# EAGLE design LEDARRAY (EAGLE 8.6.0)
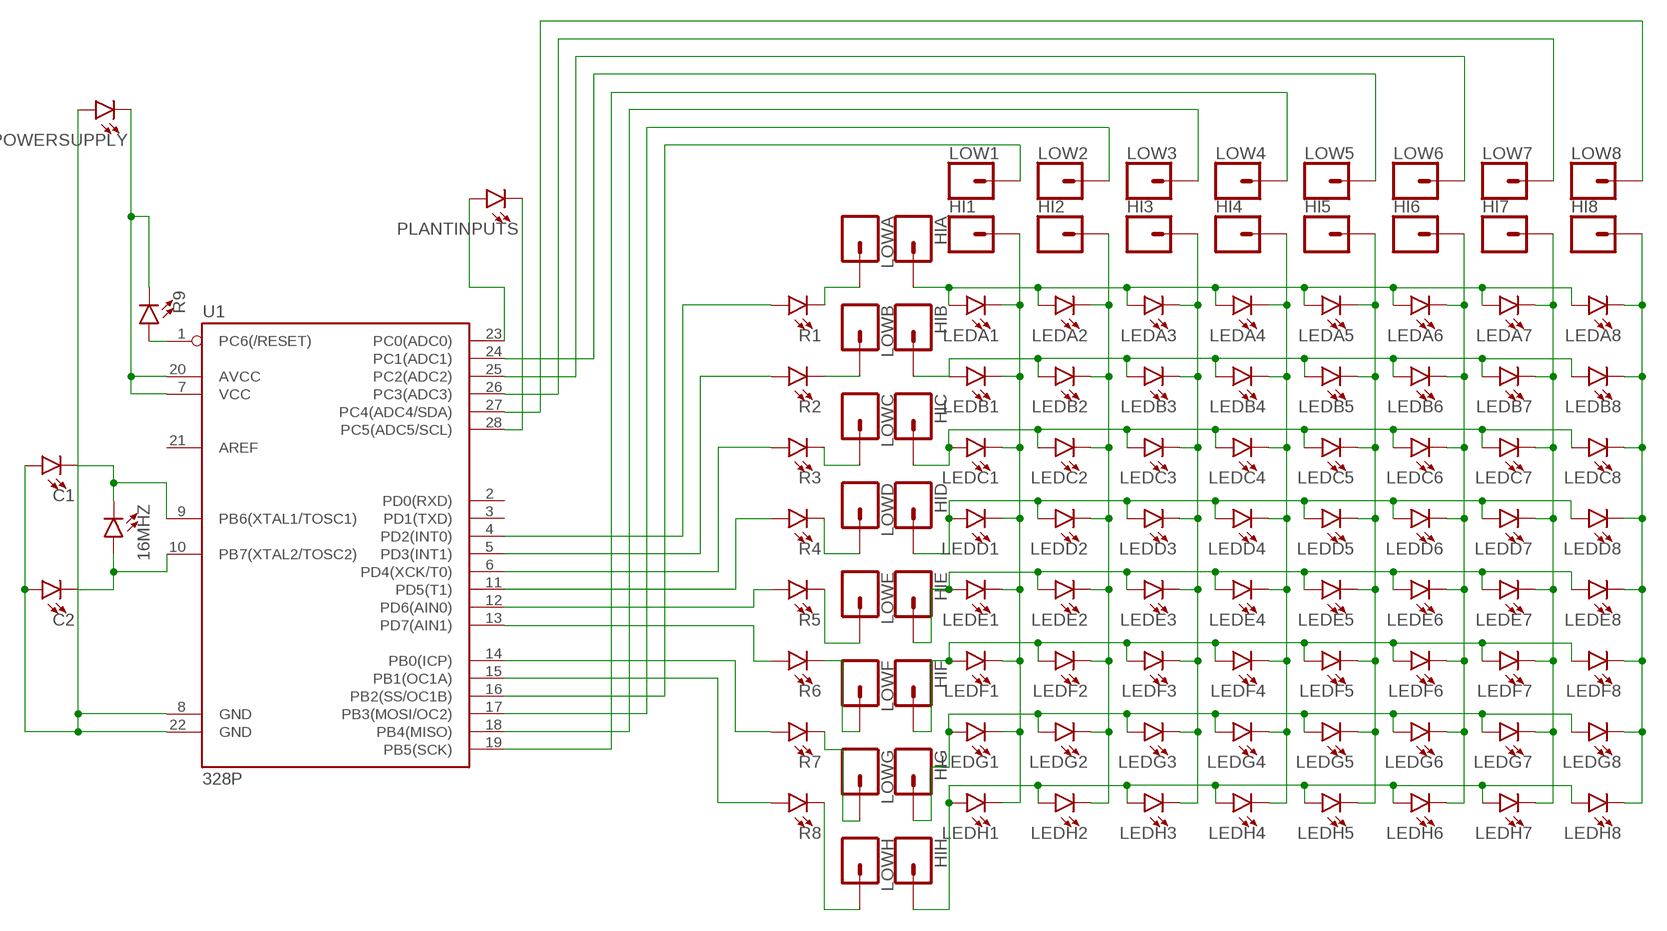
[diagram p0: schematic, sheet 1]

## Parts
16MHZ  LED3MM  [LED_3MM]
C1  LED3MM  [LED_3MM]
C2  LED3MM  [LED_3MM]
HI1  CONN_01PTH_NO_SILK_KIT  [1X01NS_KIT]
HI2  CONN_01PTH_NO_SILK_KIT  [1X01NS_KIT]
HI3  CONN_01PTH_NO_SILK_KIT  [1X01NS_KIT]
HI4  CONN_01PTH_NO_SILK_KIT  [1X01NS_KIT]
HI5  CONN_01PTH_NO_SILK_KIT  [1X01NS_KIT]
HI6  CONN_01PTH_NO_SILK_KIT  [1X01NS_KIT]
HI7  CONN_01PTH_NO_SILK_KIT  [1X01NS_KIT]
HI8  CONN_01PTH_NO_SILK_KIT  [1X01NS_KIT]
HIA  CONN_01PTH_NO_SILK_KIT  [1X01NS_KIT]
HIB  CONN_01PTH_NO_SILK_KIT  [1X01NS_KIT]
HIC  CONN_01PTH_NO_SILK_KIT  [1X01NS_KIT]
HID  CONN_01PTH_NO_SILK_KIT  [1X01NS_KIT]
HIE  CONN_01PTH_NO_SILK_KIT  [1X01NS_KIT]
HIF  CONN_01PTH_NO_SILK_KIT  [1X01NS_KIT]
HIG  CONN_01PTH_NO_SILK_KIT  [1X01NS_KIT]
HIH  CONN_01PTH_NO_SILK_KIT  [1X01NS_KIT]
LEDA1  LED3MM  [LED_3MM]
LEDA2  LED3MM  [LED_3MM]
LEDA3  LED3MM  [LED_3MM]
LEDA4  LED3MM  [LED_3MM]
LEDA5  LED3MM  [LED_3MM]
LEDA6  LED3MM  [LED_3MM]
LEDA7  LED3MM  [LED_3MM]
LEDA8  LED3MM  [LED_3MM]
LEDB1  LED3MM  [LED_3MM]
LEDB2  LED3MM  [LED_3MM]
LEDB3  LED3MM  [LED_3MM]
LEDB4  LED3MM  [LED_3MM]
LEDB5  LED3MM  [LED_3MM]
LEDB6  LED3MM  [LED_3MM]
LEDB7  LED3MM  [LED_3MM]
LEDB8  LED3MM  [LED_3MM]
LEDC1  LED3MM  [LED_3MM]
LEDC2  LED3MM  [LED_3MM]
LEDC3  LED3MM  [LED_3MM]
LEDC4  LED3MM  [LED_3MM]
LEDC5  LED3MM  [LED_3MM]
LEDC6  LED3MM  [LED_3MM]
LEDC7  LED3MM  [LED_3MM]
LEDC8  LED3MM  [LED_3MM]
LEDD1  LED3MM  [LED_3MM]
LEDD2  LED3MM  [LED_3MM]
LEDD3  LED3MM  [LED_3MM]
LEDD4  LED3MM  [LED_3MM]
LEDD5  LED3MM  [LED_3MM]
LEDD6  LED3MM  [LED_3MM]
LEDD7  LED3MM  [LED_3MM]
LEDD8  LED3MM  [LED_3MM]
LEDE1  LED3MM  [LED_3MM]
LEDE2  LED3MM  [LED_3MM]
LEDE3  LED3MM  [LED_3MM]
LEDE4  LED3MM  [LED_3MM]
LEDE5  LED3MM  [LED_3MM]
LEDE6  LED3MM  [LED_3MM]
LEDE7  LED3MM  [LED_3MM]
LEDE8  LED3MM  [LED_3MM]
LEDF1  LED3MM  [LED_3MM]
LEDF2  LED3MM  [LED_3MM]
LEDF3  LED3MM  [LED_3MM]
LEDF4  LED3MM  [LED_3MM]
LEDF5  LED3MM  [LED_3MM]
LEDF6  LED3MM  [LED_3MM]
LEDF7  LED3MM  [LED_3MM]
LEDF8  LED3MM  [LED_3MM]
LEDG1  LED3MM  [LED_3MM]
LEDG2  LED3MM  [LED_3MM]
LEDG3  LED3MM  [LED_3MM]
LEDG4  LED3MM  [LED_3MM]
LEDG5  LED3MM  [LED_3MM]
LEDG6  LED3MM  [LED_3MM]
LEDG7  LED3MM  [LED_3MM]
LEDG8  LED3MM  [LED_3MM]
LEDH1  LED3MM  [LED_3MM]
LEDH2  LED3MM  [LED_3MM]
LEDH3  LED3MM  [LED_3MM]
LEDH4  LED3MM  [LED_3MM]
LEDH5  LED3MM  [LED_3MM]
LEDH6  LED3MM  [LED_3MM]
LEDH7  LED3MM  [LED_3MM]
LEDH8  LED3MM  [LED_3MM]
LOW1  CONN_01PTH_NO_SILK_KIT  [1X01NS_KIT]
LOW2  CONN_01PTH_NO_SILK_KIT  [1X01NS_KIT]
LOW3  CONN_01PTH_NO_SILK_KIT  [1X01NS_KIT]
LOW4  CONN_01PTH_NO_SILK_KIT  [1X01NS_KIT]
LOW5  CONN_01PTH_NO_SILK_KIT  [1X01NS_KIT]
LOW6  CONN_01PTH_NO_SILK_KIT  [1X01NS_KIT]
LOW7  CONN_01PTH_NO_SILK_KIT  [1X01NS_KIT]
LOW8  CONN_01PTH_NO_SILK_KIT  [1X01NS_KIT]
LOWA  CONN_01PTH_NO_SILK_KIT  [1X01NS_KIT]
LOWB  CONN_01PTH_NO_SILK_KIT  [1X01NS_KIT]
LOWC  CONN_01PTH_NO_SILK_KIT  [1X01NS_KIT]
LOWD  CONN_01PTH_NO_SILK_KIT  [1X01NS_KIT]
LOWE  CONN_01PTH_NO_SILK_KIT  [1X01NS_KIT]
LOWF  CONN_01PTH_NO_SILK_KIT  [1X01NS_KIT]
LOWG  CONN_01PTH_NO_SILK_KIT  [1X01NS_KIT]
LOWH  CONN_01PTH_NO_SILK_KIT  [1X01NS_KIT]
PLANTINPUTS  LED3MM  [LED_3MM]
POWERSUPPLY  LED3MM  [LED_3MM]
R1  LED3MM  [LED_3MM]
R2  LED3MM  [LED_3MM]
R3  LED3MM  [LED_3MM]
R4  LED3MM  [LED_3MM]
R5  LED3MM  [LED_3MM]
R6  LED3MM  [LED_3MM]
R7  LED3MM  [LED_3MM]
R8  LED3MM  [LED_3MM]
R9  LED3MM  [LED_3MM]
U1  328P  ATMEGA328P_PDIP  [DIP28]

## Nets
LEDD1: LOW1.1 U1.16(PB2(SS/OC1B))
N$1: R8.A U1.15(PB1(OC1A))
N$2: HIG.1 LEDG1.A LEDG2.A LEDG3.A LEDG4.A LEDG5.A LEDG6.A LEDG7.A LEDG8.A
N$3: HIF.1 LEDF1.A LEDF2.A LEDF3.A LEDF4.A LEDF5.A LEDF6.A LEDF7.A LEDF8.A
N$4: HIH.1 LEDH1.A LEDH2.A LEDH3.A LEDH4.A LEDH5.A LEDH6.A LEDH7.A LEDH8.A
N$5: HID.1 LEDD1.A LEDD2.A LEDD3.A LEDD4.A LEDD5.A LEDD6.A LEDD7.A LEDD8.A
N$6: LOWD.1 R4.K(C)
N$7: R6.A U1.13(PD7(AIN1))
N$8: LOW6.1 U1.25(PC2(ADC2))
N$9: LOW2.1 U1.17(PB3(MOSI/OC2))
N$10: R7.A U1.14(PB0(ICP))
N$11: LOW3.1 U1.18(PB4(MISO))
N$12: HIB.1 LEDB1.A LEDB2.A LEDB3.A LEDB4.A LEDB5.A LEDB6.A LEDB7.A LEDB8.A
N$13: PLANTINPUTS.A U1.23(PC0(ADC0))
N$14: LOW5.1 U1.24(PC1(ADC1))
N$15: HIE.1 LEDE1.A LEDE2.A LEDE3.A LEDE4.A LEDE5.A LEDE6.A LEDE7.A LEDE8.A
N$16: 16MHZ.K(C) C1.K(C) U1.9(PB6(XTAL1/TOSC1))
N$17: R9.A U1.1(PC6(/RESET))
N$18: R5.A U1.12(PD6(AIN0))
N$19: R4.A U1.11(PD5(T1))
N$20: LOW7.1 U1.26(PC3(ADC3))
N$21: HIC.1 LEDC1.A LEDC2.A LEDC3.A LEDC4.A LEDC5.A LEDC6.A LEDC7.A LEDC8.A
N$22: LOW8.1 U1.27(PC4(ADC4/SDA))
N$23: R2.A U1.5(PD3(INT1))
N$24: R1.A U1.4(PD2(INT0))
N$25: PLANTINPUTS.K(C) U1.28(PC5(ADC5/SCL))
N$26: POWERSUPPLY.K(C) R9.K(C) U1.7(VCC) U1.20(AVCC)
N$27: LOW4.1 U1.19(PB5(SCK))
N$28: 16MHZ.A C2.K(C) U1.10(PB7(XTAL2/TOSC2))
N$29: LOWC.1 R3.K(C)
N$30: R3.A U1.6(PD4(XCK/T0))
N$31: LOWB.1 R2.K(C)
N$32: HIA.1 LEDA1.A LEDA2.A LEDA3.A LEDA4.A LEDA5.A LEDA6.A LEDA7.A LEDA8.A
N$33: LOWA.1 R1.K(C)
N$34: LOWE.1 R5.K(C)
N$35: LOWF.1 R6.K(C)
N$36: LOWG.1 R7.K(C)
N$37: LOWH.1 R8.K(C)
N$38: HI1.1 LEDA1.K(C) LEDB1.K(C) LEDC1.K(C) LEDD1.K(C) LEDE1.K(C) LEDF1.K(C) LEDG1.K(C) LEDH1.K(C)
N$39: HI2.1 LEDA2.K(C) LEDB2.K(C) LEDC2.K(C) LEDD2.K(C) LEDE2.K(C) LEDF2.K(C) LEDG2.K(C) LEDH2.K(C)
N$40: HI3.1 LEDA3.K(C) LEDB3.K(C) LEDC3.K(C) LEDD3.K(C) LEDE3.K(C) LEDF3.K(C) LEDG3.K(C) LEDH3.K(C)
N$41: HI4.1 LEDA4.K(C) LEDB4.K(C) LEDC4.K(C) LEDD4.K(C) LEDE4.K(C) LEDF4.K(C) LEDG4.K(C) LEDH4.K(C)
N$42: HI5.1 LEDA5.K(C) LEDB5.K(C) LEDC5.K(C) LEDD5.K(C) LEDE5.K(C) LEDF5.K(C) LEDG5.K(C) LEDH5.K(C)
N$43: HI6.1 LEDA6.K(C) LEDB6.K(C) LEDC6.K(C) LEDD6.K(C) LEDE6.K(C) LEDF6.K(C) LEDG6.K(C) LEDH6.K(C)
N$44: HI7.1 LEDA7.K(C) LEDB7.K(C) LEDC7.K(C) LEDD7.K(C) LEDE7.K(C) LEDF7.K(C) LEDG7.K(C) LEDH7.K(C)
N$45: HI8.1 LEDA8.K(C) LEDB8.K(C) LEDC8.K(C) LEDD8.K(C) LEDE8.K(C) LEDF8.K(C) LEDG8.K(C) LEDH8.K(C)
POWERSUPPLY: C1.A C2.A POWERSUPPLY.A U1.8(GND) U1.22(GND)
Unconnected: U1.2(PD0(RXD)) U1.3(PD1(TXD)) U1.21(AREF)

## Library data of the parts
16MHZ C1 C2 LEDA1-LEDA8 LEDB1-LEDB8 LEDC1-LEDC8 LEDD1-LEDD8 LEDE1-LEDE8 LEDF1-LEDF8 LEDG1-LEDG8 LEDH1-LEDH8 PLANTINPUTS POWERSUPPLY R1-R9 = SparkFun-LED:LED: LED (Generic) Standard schematic elements and footprints for 5mm, 3mm, 1206, and 0603 sized LEDs. Generic LEDs with no color specified.; PROD_ID: DIO-08794
HI1-HI8 HIA HIB HIC HID HIE HIF HIG HIH LOW1-LOW8 LOWA LOWB LOWC LOWD LOWE LOWF LOWG LOWH = SparkFun-Connectors:CONN_01: Single connection point. Often used as Generic Header-pin footprint for 0.1 inch spaced/style header connections On any of the 0.1 inch spaced packages, you can populate with these: Break Away Headers - Straight <https://www.sparkfun.com/products/116> (PRT-00116) Break Away Male Headers - Right Angle <https://www.sparkfun.com/products/553> (PRT-00553) Female Headers <https://www.sparkfun.com/products/115> (PRT-00115) Break Away Headers - Machine Pin <https://www.sparkfun.com/products/117> (PRT-00117) Break Away Female Headers - Swiss Machine Pin <https://www.sparkfun.com/products/743> (PRT-00743) This device is also useful as a general connection point to wire up your design to another part of your project. Our various solder wires solder well into these plated through hole pads. Hook-Up Wire - Assortment (Stranded, 22 AWG) <https://www.sparkfun.com/products/11375> (PRT-11375) Hook-Up Wire - Assortment (Solid Core, 22 AWG) <https://www.sparkfun.com/products/11367> (PRT-11367) View the entire wire category on our website here <https://www.sparkfun.com/categories/141> Special notes: SMTSO-256-ET is a "flush mount" nut for a 4-40 screw. We mostly use this on specialty testbeds; it is a nice way to connect hardware to your PCB at an adjustable hieght. Also note, the SNAP packages are for using a snappable style connector. We sell a baggie of snaps and they are also used on two LilyPad designs: Snap Assortment - 30 pack (male and female) <https://www.sparkfun.com/products/11347> (DEV-11347) LilyPad Arduino SimpleSnap <https://www.sparkfun.com/products/10941> (DEV-10941) LilyPad SimpleSnap Protoboard <https://www.sparkfun.com/products/10940> (DEV-10940)
U1 = SparkFun-IC-Microcontroller:ATMEGA328P_PDIP: Atmel 328P Through hole ATMEGA328P uC used in the Arduino 32kb flash, 1k EEPROM, 2k SRAM Datasheet <http://www.sparkfun.com/datasheets/Components/SMD/ATMega328.pdf> SparkFun Products Storefront component: AVR 28 Pin 20MHz 32K 6A/D - ATMega328P <https://www.sparkfun.com/products/9061> (COM-09061) SparkFun Simon Says - Through-Hole Soldering Kit <https://www.sparkfun.com/products/10547> (KIT-10547) SparkFun Learn to Solder - Simon Says <https://www.sparkfun.com/products/13708> (KIT-13708) SparkFun BigTime Watch Kit <https://www.sparkfun.com/products/11734> (KIT-11734) SparkFun ClockIt <https://www.sparkfun.com/products/10930> (KIT-10930) SparkFun Serial Enabled LCD Kit <https://www.sparkfun.com/products/10097> (LCD-10097) SparkFun Simon Tilts - Through Hole Soldering Kit <https://www.sparkfun.com/products/12634> (KIT-12634) SparkFun Frequency Counter Kit <https://www.sparkfun.com/products/10140> (KIT-10140) FabFM Radio Kit <https://www.sparkfun.com/products/11043> (KIT-11043) SparkFun Binary Blaster Kit <https://www.sparkfun.com/products/12037> (KIT-12037) SparkFun Metro-Gnome <https://www.sparkfun.com/products/9236> (KIT-09236) ATmega328 with Arduino Optiboot (Uno) <https://www.sparkfun.com/products/10524> (DEV-10524); PROD_ID: IC-09136

## Board
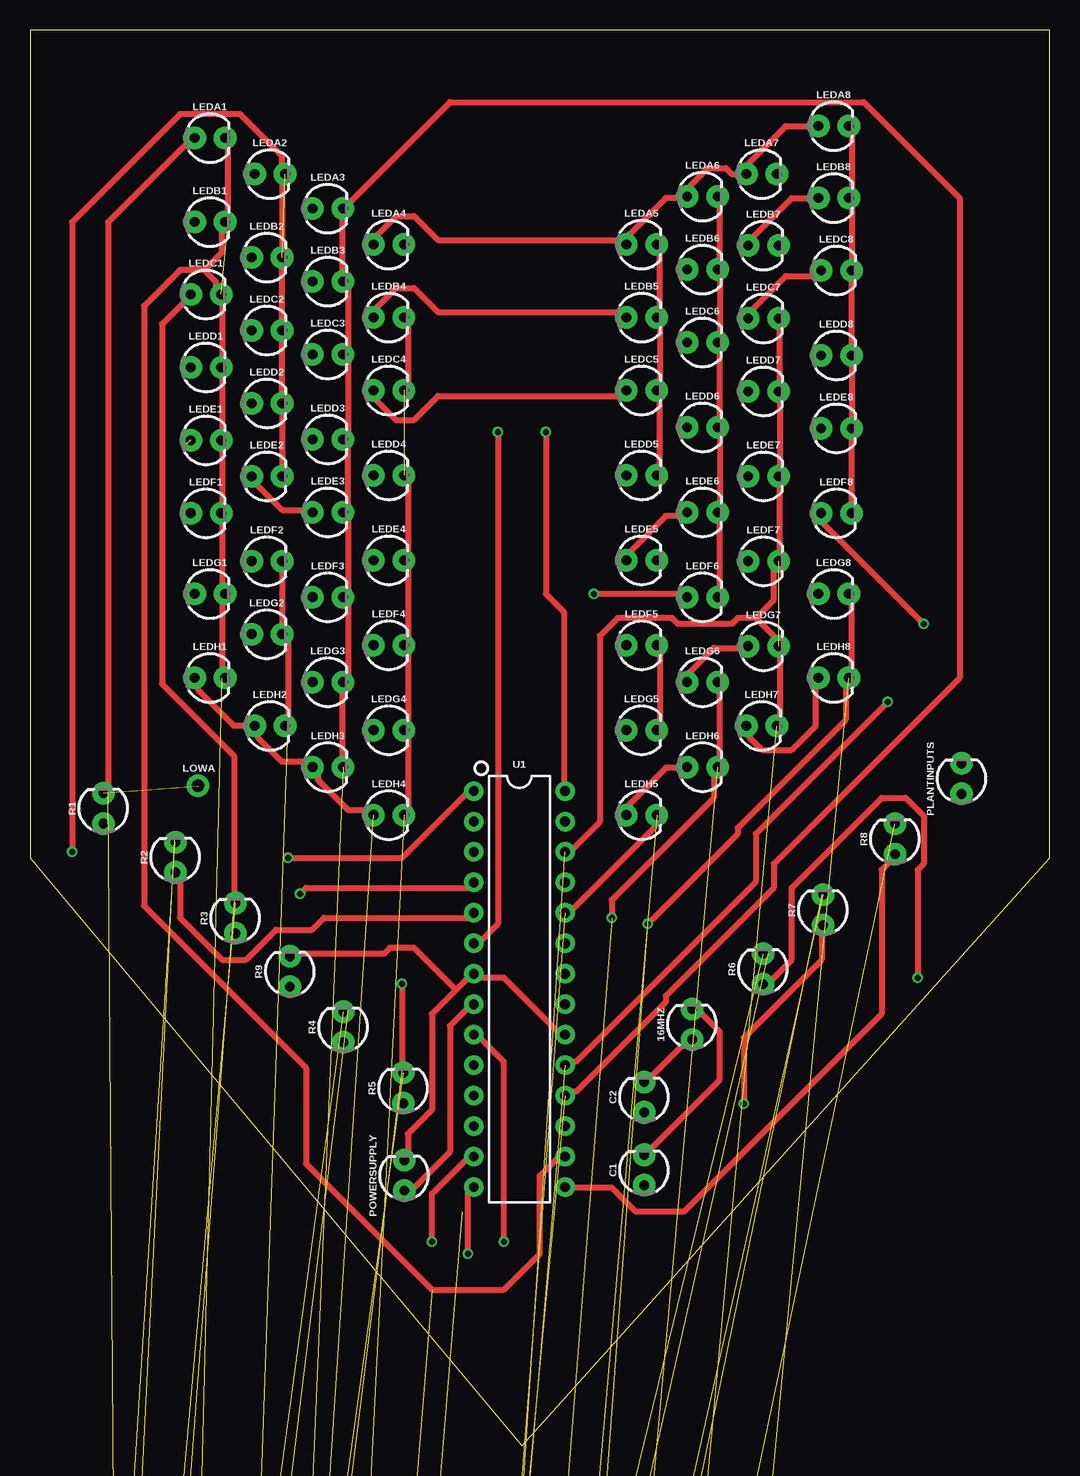
[diagram p1: board, top side]
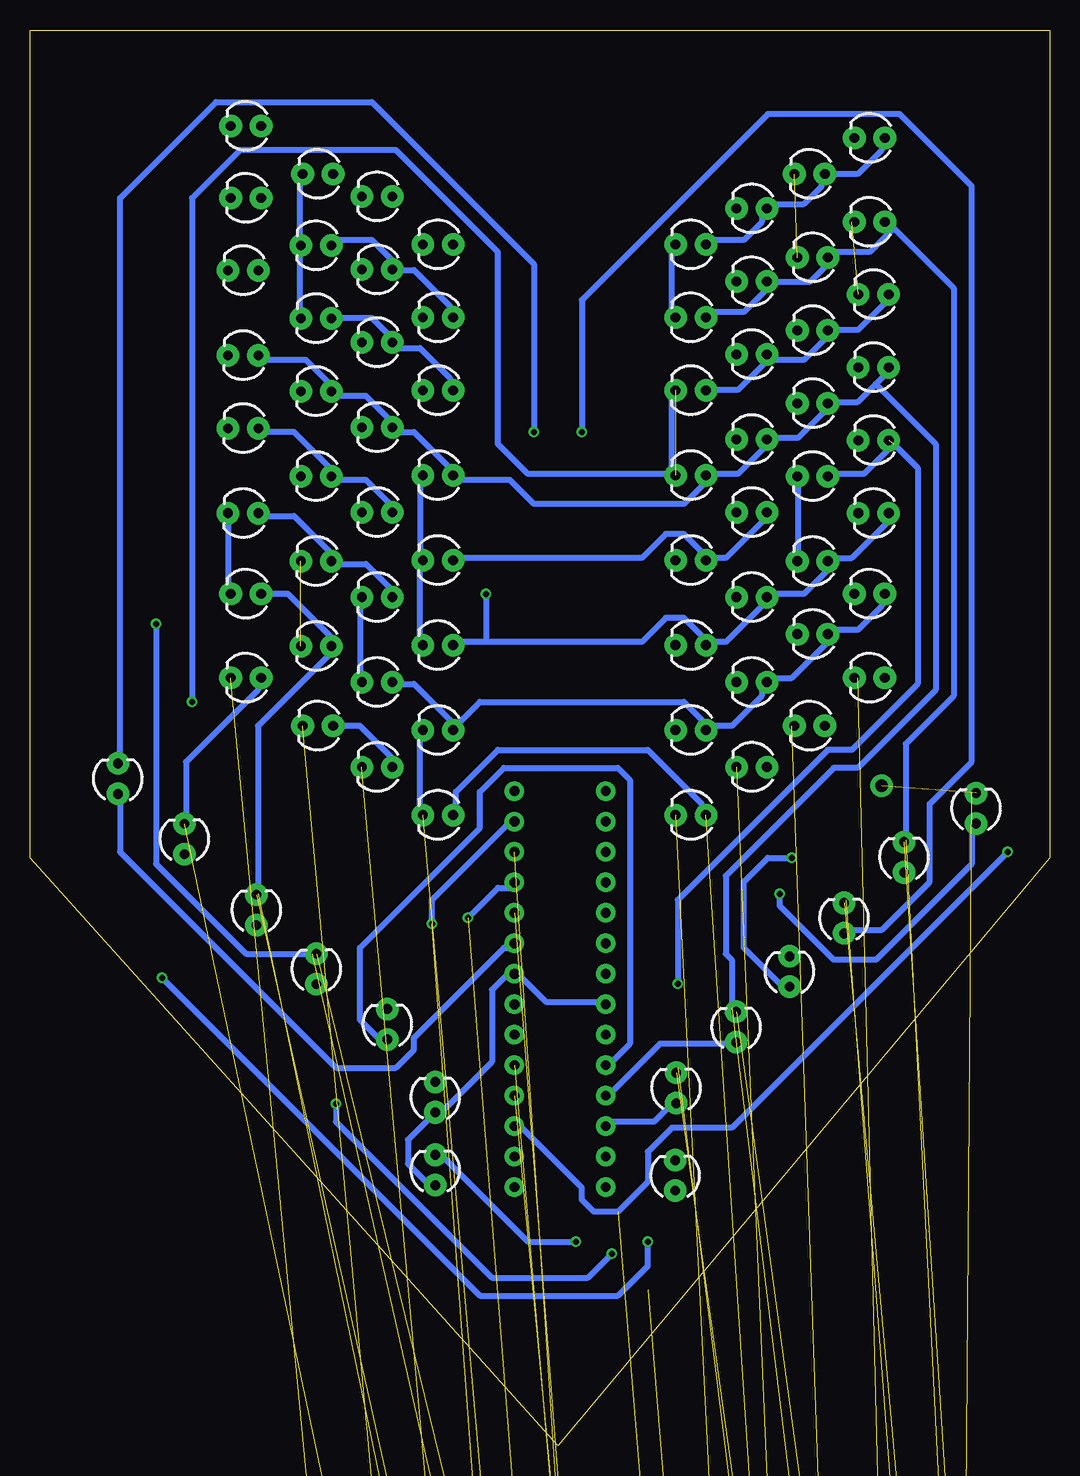
[diagram p2: board, bottom side, seen from below]

Size 85 x 118 mm. Coordinates in mm from the lower left corner, seen from the top.
Outline: 41,0 85,49 85,118 0,118 0,49 41,0
Copper layers (1*16): Top 0.035mm / dielectric 1.5mm / Bottom 0.035mm
Design rules "default *": minimum track width 0.5mm, minimum drill 0.5mm, track to track 0.8mm, track to pad 0.8mm, pad to pad 0.6mm, via to via 2mm, smd to smd 1mm, copper to edge 40mil, drill to drill 6mil, minimum pad ring 10mil, minimum via ring 8mil, stop-mask expansion 4mil, vias tented up to drill 0mil, thermal gap 10mil

### Footprints (pad centres in the part's own frame; a part is rotated, then mirrored left to right if it is on the bottom)
LED_3MM = drill 0.813 pad 1.88: A -1.27,0; K 1.27,0
1X01NS_KIT = drill 1.016 pad 1.88: 1 0,0
DIP28 = drill 0.813 pad 1.626: 1 -16.51,-3.81; 2 -13.97,-3.81; 3 -11.43,-3.81; 4 -8.89,-3.81; 5 -6.35,-3.81; 6 -3.81,-3.81; 7 -1.27,-3.81; 8 1.27,-3.81; 9 3.81,-3.81; 10 6.35,-3.81; 11 8.89,-3.81; 12 11.43,-3.81; 13 13.97,-3.81; 14 16.51,-3.81; 15 16.51,3.81; 16 13.97,3.81; 17 11.43,3.81; 18 8.89,3.81; 19 6.35,3.81; 20 3.81,3.81; 21 1.27,3.81; 22 -1.27,3.81; 23 -3.81,3.81; 24 -6.35,3.81; 25 -8.89,3.81; 26 -11.43,3.81; 27 -13.97,3.81; 28 -16.51,3.81

### Placement (x,y rotation side)
16MHZ  55.2,35.12 90 top
C1  51.2,22.96 90 top
C2  51.2,29.04 90 top
HI1  7,-295 0 top  (outside the outline)
HI2  7,-352 0 top  (outside the outline)
HI3  7,-390 0 top  (outside the outline)
HI4  7,-428 0 top  (outside the outline)
HI5  7,-466 0 top  (outside the outline)
HI6  7,-504 0 top  (outside the outline)
HI7  7,-542 0 top  (outside the outline)
HI8  7,-580 0 top  (outside the outline)
HIA  7,-10 0 top  (outside the outline)
HIB  7,-48 0 top  (outside the outline)
HIC  7,-86 0 top  (outside the outline)
HID  7,-124 0 top  (outside the outline)
HIE  7,-162 0 top  (outside the outline)
HIF  7,-200 0 top  (outside the outline)
HIG  7,-238 0 top  (outside the outline)
HIH  7,-276 0 top  (outside the outline)
LEDA1  15,109 0 top
LEDA2  20,106 0 top
LEDA3  24.83,103.12 0 top
LEDA4  29.91,100.12 0 top
LEDA5  50.99,100.12 0 top
LEDA6  56.07,104.12 0 top
LEDA7  61,106 0 top
LEDA8  67,110 0 top
LEDB1  15,102 0 top
LEDB2  19.75,99.04 0 top
LEDB3  24.83,97.04 0 top
LEDB4  29.91,94.04 0 top
LEDB5  50.99,94.04 0 top
LEDB6  56.07,98.04 0 top
LEDB7  61.15,100.04 0 top
LEDB8  67,104 0 top
LEDC1  14.67,95.96 0 top
LEDC2  19.75,92.96 0 top
LEDC3  24.83,90.96 0 top
LEDC4  29.91,87.96 0 top
LEDC5  50.99,87.96 0 top
LEDC6  56.07,91.96 0 top
LEDC7  61.15,93.96 0 top
LEDC8  67.23,97.96 0 top
LEDD1  14.67,89.88 0 top
LEDD2  19.75,86.88 0 top
LEDD3  24.83,83.88 0 top
LEDD4  29.91,80.88 0 top
LEDD5  50.99,80.88 0 top
LEDD6  56.07,84.88 0 top
LEDD7  61.15,87.88 0 top
LEDD8  67.23,90.88 0 top
LEDE1  14.67,83.8 0 top
LEDE2  19.75,80.8 0 top
LEDE3  24.83,77.8 0 top
LEDE4  29.91,73.8 0 top
LEDE5  50.99,73.8 0 top
LEDE6  56.07,77.8 0 top
LEDE7  61.15,80.8 0 top
LEDE8  67.23,84.8 0 top
LEDF1  14.67,77.72 0 top
LEDF2  19.75,73.72 0 top
LEDF3  24.83,70.72 0 top
LEDF4  29.91,66.72 0 top
LEDF5  50.99,66.72 0 top
LEDF6  56.07,70.72 0 top
LEDF7  61.15,73.72 0 top
LEDF8  67.23,77.72 0 top
LEDG1  15,71 0 top
LEDG2  19.75,67.64 0 top
LEDG3  24.83,63.64 0 top
LEDG4  29.91,59.64 0 top
LEDG5  50.99,59.64 0 top
LEDG6  56.07,63.64 0 top
LEDG7  61.15,66.64 0 top
LEDG8  67,71 0 top
LEDH1  15,64 0 top
LEDH2  20,60 0 top
LEDH3  24.83,56.56 0 top
LEDH4  29.91,52.56 0 top
LEDH5  50.99,52.56 0 top
LEDH6  56.07,56.56 0 top
LEDH7  61,60 0 top
LEDH8  67,64 0 top
LOW1  7,-314 0 top  (outside the outline)
LOW2  7,-333 0 top  (outside the outline)
LOW3  7,-371 0 top  (outside the outline)
LOW4  7,-409 0 top  (outside the outline)
LOW5  7,-447 0 top  (outside the outline)
LOW6  7,-485 0 top  (outside the outline)
LOW7  7,-523 0 top  (outside the outline)
LOW8  7,-561 0 top  (outside the outline)
LOWA  14,55 0 top
LOWB  7,-29 0 top  (outside the outline)
LOWC  7,-67 0 top  (outside the outline)
LOWD  7,-105 0 top  (outside the outline)
LOWE  7,-143 0 top  (outside the outline)
LOWF  7,-181 0 top  (outside the outline)
LOWG  7,-219 0 top  (outside the outline)
LOWH  7,-257 0 top  (outside the outline)
PLANTINPUTS  77.67,55.59 90 top
POWERSUPPLY  31.2,22.51 90 top
R1  6.12,53.12 90 top
R2  12.12,49.04 90 top
R3  17.12,43.96 90 top
R4  26.12,34.88 90 top
R5  31.12,29.8 90 top
R6  61.12,39.72 90 top
R7  66.12,44.64 90 top
R8  72.12,50.56 90 top
R9  21.67,39.51 90 top
U1  40.8,38.05 270 top

### Tracks (layer width: path | path; a pad name or v marks a point on that pad's centre or on a via)
LEDD1  (1 unrouted)
  Top 0.5: 14.5,98 12.5,98 9.5,95 9.5,45 23,31.5 23,23.5 33.5,13 39.5,13 42.5,16 42.5,22.5 44,24 44.5,24 U1.16 | 14.5,98 15.5,97 15.5,96 | 16,102 16,99.5 14.5,98
N$1
  Top 0.5: U1.15 45,21.5 48.5,21.5 50.5,19.5 54.5,19.5 71,36 71,48 72,49 R8.A
N$2  (1 unrouted)
  Top 0.5: LEDG7.A 59.5,66.5 57,66.5 54.5,64 LEDG6.A
  Bottom 0.5: LEDG1.A 14,71 14,70 16,68 18,68 LEDG2.A 18.5,67.5 18.5,67 21.5,64 23.5,64 LEDG3.A 24,63.5 24,62.5 26.5,60 28.5,60 LEDG4.A 29,60 29,60.5 30.5,62 47.5,62 49.5,60 LEDG5.A 50,60 50,60.5 53,63.5 54.5,63.5 LEDG6.A | 66,46 66,60 59.5,66.5 LEDG7.A 59.5,67 63.5,71 LEDG8.A
N$3  (via drill 0.5)  (1 unrouted)
  Top 0.5: v74.5,68.5 65.5,77.5 LEDF8.A | v47,71 54.5,71 LEDF6.A
  Bottom 0.5: 28.5,67 27,67 23.5,70.5 LEDF3.A 23.5,71 20.5,71 18,73.5 LEDF2.A 18,74 16.5,74 13.5,77 13.5,77.5 LEDF1.A | 47,67 34,67 32,69 30.5,69 28.5,67 | 47,67 49.5,67 LEDF5.A | 28.5,67 LEDF4.A | LEDF6.A 55,71 55,71.5 57,73.5 59.5,73.5 LEDF7.A 60,74 60,74.5 63,77.5 65.5,77.5 LEDF8.A | 61.5,41 67,41 74.5,48.5 v74.5,68.5 | v47,71 47,67
N$4  (1 unrouted)
  Top 0.5: LEDH4.A 28.5,53 26.5,53 24,55.5 24,56.5 LEDH3.A 23.5,57 21,57 19,59 19,60 LEDH2.A 17,60 14,63 14,64 LEDH1.A | LEDH5.A 50,53 50,53.5 53,56.5 54.5,56.5 LEDH6.A | LEDH8.A 65.5,64 65.5,60 63.5,58 61,58 60,59 60,60 LEDH7.A
  Bottom 0.5: LEDH7.A 57.5,60 54.5,57 LEDH6.A | 72,52 72,57 66,63 66,64 LEDH8.A | LEDH4.A 29,53 29,53.5 33.5,58 46,58 49.5,54.5 49.5,53 LEDH5.A
N$5  (1 unrouted)
  Bottom 0.5: LEDD8.A 65.5,90.5 62,90.5 59.5,88 LEDD7.A 59.5,87.5 57,87.5 54.5,85 LEDD6.A 54.5,84.5 53,84.5 50,81.5 50,81 LEDD5.A 49.5,80.5 45,80.5 43,78.5 30.5,78.5 28.5,80.5 LEDD4.A 28.5,81 26,81 23.5,83.5 LEDD3.A 23.5,84 21,84 18.5,86.5 LEDD2.A 18,87 16,87 14.5,88.5 | 14.5,88.5 13.5,89.5 LEDD1.A | 26.5,36.5 26.5,40.5 27,41 27,47.5 18,56.5 16,56.5 9.5,63 9.5,83.5 14.5,88.5
N$6  (1 unrouted)
N$7  (via drill 0.5)
  Top 0.5: v33.5,17 33.5,21 36.5,24 U1.13 | v74,39 74,48 74.5,48.5 74.5,52.5 73,54 71,54 63.5,46.5 63.5,40.5 61.5,38.5 R6.A
  Bottom 0.5: v33.5,17 33.5,15 36,12.5 47.5,12.5 v74,39
N$8  (via drill 0.5)  (1 unrouted)
  Top 0.5: v48.5,44 48.5,45.5 57,54 57,56.5
  Bottom 0.5: v48.5,44 46,46.5 45,46.5 U1.25
N$9  (via drill 0.5)  (1 unrouted)
  Top 0.5: v3.5,49.5 3.5,102 12.5,111 17.5,111 21,107.5 21,106 21,99.5
  Bottom 0.5: v3.5,49.5 26.5,26.5 31.5,26.5 33.5,24.5 33.5,22 36,19.5 38,19.5 39,20.5 39,21.5 44,26.5 44.5,26.5 U1.17
N$10  (via drill 0.5)
  Top 0.5: v36.5,16 36.5,21.5 U1.14 | v59.5,28.5 59.5,34 66,40.5 66,43 R7.A
  Bottom 0.5: v36.5,16 38.5,14 46.5,14 59.5,27 v59.5,28.5
N$11  (1 unrouted)
  Top 0.5: 26.5,103.5 35,112 69.5,112 77.5,104 77.5,64 62,48.5 62,46.5 53,37.5 53,37 45.5,29.5 45,29.5 U1.18
N$12  (1 unrouted)
  Top 0.5: LEDB8.A 63.5,104 60,100.5 LEDB7.A | LEDB5.A 49.5,94.5 34,94.5 32,96.5 30.5,96.5 28.5,94.5 LEDB4.A
  Bottom 0.5: LEDB5.A 50,94.5 50,95 53,98 54.5,98 LEDB6.A 54.5,98.5 56.5,100.5 59.5,100.5 LEDB7.A | 12,50.5 12,58.5 8,62.5 8,96.5 13,101.5 | 13,101.5 13.5,102 LEDB1.A 13,101.5 | 13,101.5 15,99.5 18,99.5 LEDB2.A 18,99 20,97 23,97 | 23,97 23.5,97 LEDB3.A 23,97 | 23,97 25.5,94.5 28.5,94.5 LEDB4.A
N$13
  Bottom 0.5: U1.23 45,41.5 45.5,41.5 53,34 53,33 54.5,31.5 59.5,31.5 77.5,49.5 77.5,54 PLANTINPUTS.A
N$14  (1 unrouted)
  Top 0.5: 52,52.5 52,51.5 45,44.5 U1.24
N$15  (via drill 0.5)  (2 unrouted)
  Top 0.5: LEDE5.A 50,74 50,74.5 53,77.5 54.5,77.5 LEDE6.A | v31,38.5 31,31.5 | LEDE3.A 23.5,78 21,78 18.5,80.5 LEDE2.A
  Bottom 0.5: LEDE6.A 54.5,78 57,80.5 59.5,80.5 LEDE7.A 59.5,81 63,84.5 65.5,84.5 LEDE8.A | v31,38.5 31,45.5 18.5,58 16.5,58 11,63.5 11,81.5 13,83.5 15.5,81 18,81 LEDE2.A | 28.5,74 27,74 23.5,77.5 LEDE3.A | 28.5,74 30.5,76 32,76 34,74 49.5,74 LEDE5.A | 28.5,74 LEDE4.A
N$16  (via drill 0.5)
  Top 0.5: v39.5,17 39.5,32 37.5,34 37,34 U1.9 | 16MHZ.K 55.5,36 56,36 57.5,34.5 57.5,30.5 51.5,24.5 C1.K
  Bottom 0.5: v39.5,17 43.5,17 51,24.5 C1.K
N$17  (via drill 0.5)
  Top 0.5: v21.5,49 31,49 36.5,54.5 U1.1
  Bottom 0.5: v21.5,49 23.5,49 25.5,47 25.5,41.5 22,38 R9.A
N$18
  Bottom 0.5: U1.12 36.5,27 33,27 31.5,28.5 R5.A
N$19
  Bottom 0.5: U1.11 36.5,29.5 32.5,33.5 26.5,33.5 R4.A
N$20  (1 unrouted)
  Top 0.5: 60.5,69 59,69 58.5,68.5 54,68.5 53.5,69 49,69 47.5,67.5 47.5,52 45,49.5 U1.26 | 62.5,67 60.5,69 | 62,73.5 62,70.5 60.5,69
N$21  (1 unrouted)
  Top 0.5: LEDC8.A 65.5,97.5 63,97.5 59.5,94 LEDC7.A | 17,45.5 17,57.5 11,63.5 11,93.5 13,95.5 LEDC1.A | LEDC5.A 49.5,87.5 34,87.5 32,85.5 30.5,85.5 28.5,87.5 LEDC4.A
  Bottom 0.5: LEDC5.A 50,88 50,89 52.5,91.5 54.5,91.5 LEDC6.A 54.5,92 56.5,94 59.5,94 LEDC7.A | LEDC1.A 13.5,95.5 16,93 18,93 LEDC2.A 18.5,92.5 20.5,90.5 23.5,90.5 | 23.5,90.5 26,88 28.5,88 LEDC4.A | 23.5,90.5 LEDC3.A
N$22  (via drill 0.5)  (1 unrouted)
  Top 0.5: v51.5,43.5 59,51 59,51.5 68,60.5 68,64
  Bottom 0.5: v51.5,43.5 51.5,45.5 45,52 U1.27
N$23
  Top 0.5: U1.5 36.5,44 24.5,44 23.5,43 20.5,43 18,40.5 16,40.5 12.5,44 12.5,47.5 R2.A
N$24  (via drill 0.5)
  Top 0.5: v22.5,46 23,46.5 36.5,46.5 U1.4
  Bottom 0.5: v22.5,46 22.5,45 18,40.5 14.5,40.5 6.5,48.5 6.5,51.5 R1.A
N$25  (via drill 0.5)
  Top 0.5: v43,84.5 43,71 44.5,69.5 44.5,55 U1.28
  Bottom 0.5: v43,84.5 43,98.5 56.5,112 69.5,112 77.5,104 77.5,57 PLANTINPUTS.K
N$26
  Top 0.5: U1.20 44.5,34 39.5,39 37,39 U1.7 36.5,39 35.5,38 | 35.5,38 33.5,36 33.5,28 31.5,26 31.5,24 POWERSUPPLY.K | 35.5,38 32,41.5 30,41.5 29.5,41 22,41 R9.K
N$27  (via drill 0.5)  (1 unrouted)
  Top 0.5: v71.5,62 60.5,51 60.5,47 45.5,32 45,32 U1.19
  Bottom 0.5: v71.5,62 71.5,104 67.5,108 54.5,108 46,99.5 46,83.5 43.5,81 31.5,81 31.5,87.5
N$28
  Top 0.5: C2.K 51.5,30.5 55,34 16MHZ.A
  Bottom 0.5: U1.10 36.5,32 35,33.5 35,55.5 36,56.5 45.5,56.5 47.5,54.5 47.5,51.5 57.5,41.5 57.5,35.5 55.5,33.5 16MHZ.A
N$29  (1 unrouted)
N$30  (via drill 0.5)
  Top 0.5: v39,84.5 39,43.5 37.5,42 37,42 U1.6
  Bottom 0.5: v39,84.5 39,95.5 23.5,111 12.5,111 6.5,105 6.5,57 10,53.5 10,47 14,43 17,43 R3.A
N$31  (1 unrouted)
N$32  (1 unrouted)
  Top 0.5: 59,106 58.5,106 58,106.5 56.5,106.5 54.5,104.5 LEDA6.A 54.5,104 53,104 50,101 50,100.5 LEDA5.A 49.5,100.5 34,100.5 32,102.5 30.5,102.5 28.5,100.5 LEDA4.A | 59,106 LEDA7.A 59.5,106 | LEDA8.A 63,110 59,106 | 6.5,54.5 6.5,102 13.5,109 LEDA1.A
  Bottom 0.5: LEDA4.A 28.5,100.5 25.5,100.5 24,102 24,103 LEDA3.A 23.5,103.5 20.5,103.5 19,105 19,106 LEDA2.A 16,106 14,108 14,109 LEDA1.A
N$33  (1 unrouted)
N$34  (1 unrouted)
N$35  (1 unrouted)
N$36  (1 unrouted)
N$37  (1 unrouted)
N$38  (2 unrouted)
  Top 0.5: 16,71 16,64 LEDH1.K | LEDC1.K 16,95.5 16,90 LEDD1.K 16,89.5 16,84 LEDE1.K 16,83.5 16,78 LEDF1.K 16,77.5 16,71 | LEDA1.K 16.5,109 16.5,102 LEDB1.K | 16,71 LEDG1.K
N$39  (2 unrouted)
  Top 0.5: LEDF2.K 21,73.5 21,68 LEDG2.K 21.5,67.5 21.5,60 LEDH2.K | LEDE2.K 21,81 21,86.5 LEDD2.K 21,87 21,92.5 LEDC2.K 21,93 21,99 LEDB2.K
  Bottom 0.5: LEDF2.K 21,74 21,80.5 LEDE2.K
N$40  (1 unrouted)
  Top 0.5: LEDH3.K 26,57 26,63.5 LEDG3.K 26.5,64 26.5,70.5 LEDF3.K 26.5,71 26.5,77.5 LEDE3.K 26.5,78 26.5,83.5 LEDD3.K 26.5,84 26.5,90.5 LEDC3.K 26.5,91 26.5,97 LEDB3.K 26,97.5 26,103 LEDA3.K
N$41  (2 unrouted)
  Top 0.5: LEDH4.K 31.5,53 31.5,59.5 LEDG4.K 31.5,60 31.5,66.5 LEDF4.K 31.5,67 31.5,73.5 LEDE4.K 31.5,74 31.5,80.5 LEDD4.K | LEDC4.K 31.5,88 31.5,94 LEDB4.K
  Bottom 0.5: LEDA4.K 31.5,100 31.5,94.5 LEDB4.K
N$42  (1 unrouted)
  Top 0.5: LEDA5.K 52.5,100 52.5,94.5 LEDB5.K 52.5,94 52.5,88 LEDC5.K 52.5,87.5 52.5,81 LEDD5.K | LEDG5.K 52.5,60 52.5,66.5 LEDF5.K
  Bottom 0.5: LEDD5.K 52.5,80.5 52.5,74 LEDE5.K 52.5,73.5 52.5,67 LEDF5.K | LEDG5.K 52.5,59.5 52.5,53 LEDH5.K
N$43  (1 unrouted)
  Top 0.5: LEDA6.K 57.5,104 57.5,98.5 LEDB6.K 57.5,98 57.5,92 LEDC6.K 57.5,91.5 57.5,85 LEDD6.K 57.5,84.5 57.5,78 LEDE6.K 57.5,77.5 57.5,71 LEDF6.K | LEDG6.K 57.5,63.5 57.5,57 LEDH6.K
  Bottom 0.5: LEDG6.K 57.5,64 57.5,70.5 LEDF6.K
N$44  (2 unrouted)
  Top 0.5: LEDC7.K 62.5,93.5 62.5,88 LEDD7.K 62.5,87.5 62.5,81 LEDE7.K 62.5,80.5 62.5,74 LEDF7.K | LEDH7.K 62.5,60 62.5,66.5 LEDG7.K
  Bottom 0.5: LEDA7.K 62.5,106 62.5,100.5 LEDB7.K 62.5,100 62.5,94 LEDC7.K
N$45  (1 unrouted)
  Top 0.5: 68.5,104 68.5,110 LEDA8.K | 68.5,104 LEDC8.K LEDD8.K LEDE8.K LEDF8.K | 68.5,104 LEDB8.K | LEDG8.K 68.5,71 68.5,64 LEDH8.K
  Bottom 0.5: LEDF8.K 68.5,71 LEDG8.K
POWERSUPPLY
  Top 0.5: POWERSUPPLY.A 31.5,21.5 32,21.5 35,24.5 35,35 36.5,36.5 U1.8
  Bottom 0.5: C1.A 51.5,22 52,22 53.5,23.5 53.5,25.5 51.5,27.5 C2.A 51,28 50.5,28 46.5,32 46.5,38 45,39.5 U1.22 44.5,39.5 42,37 37,37 U1.8